# EAGLE design SoundCastel (EAGLE 9.1.1)
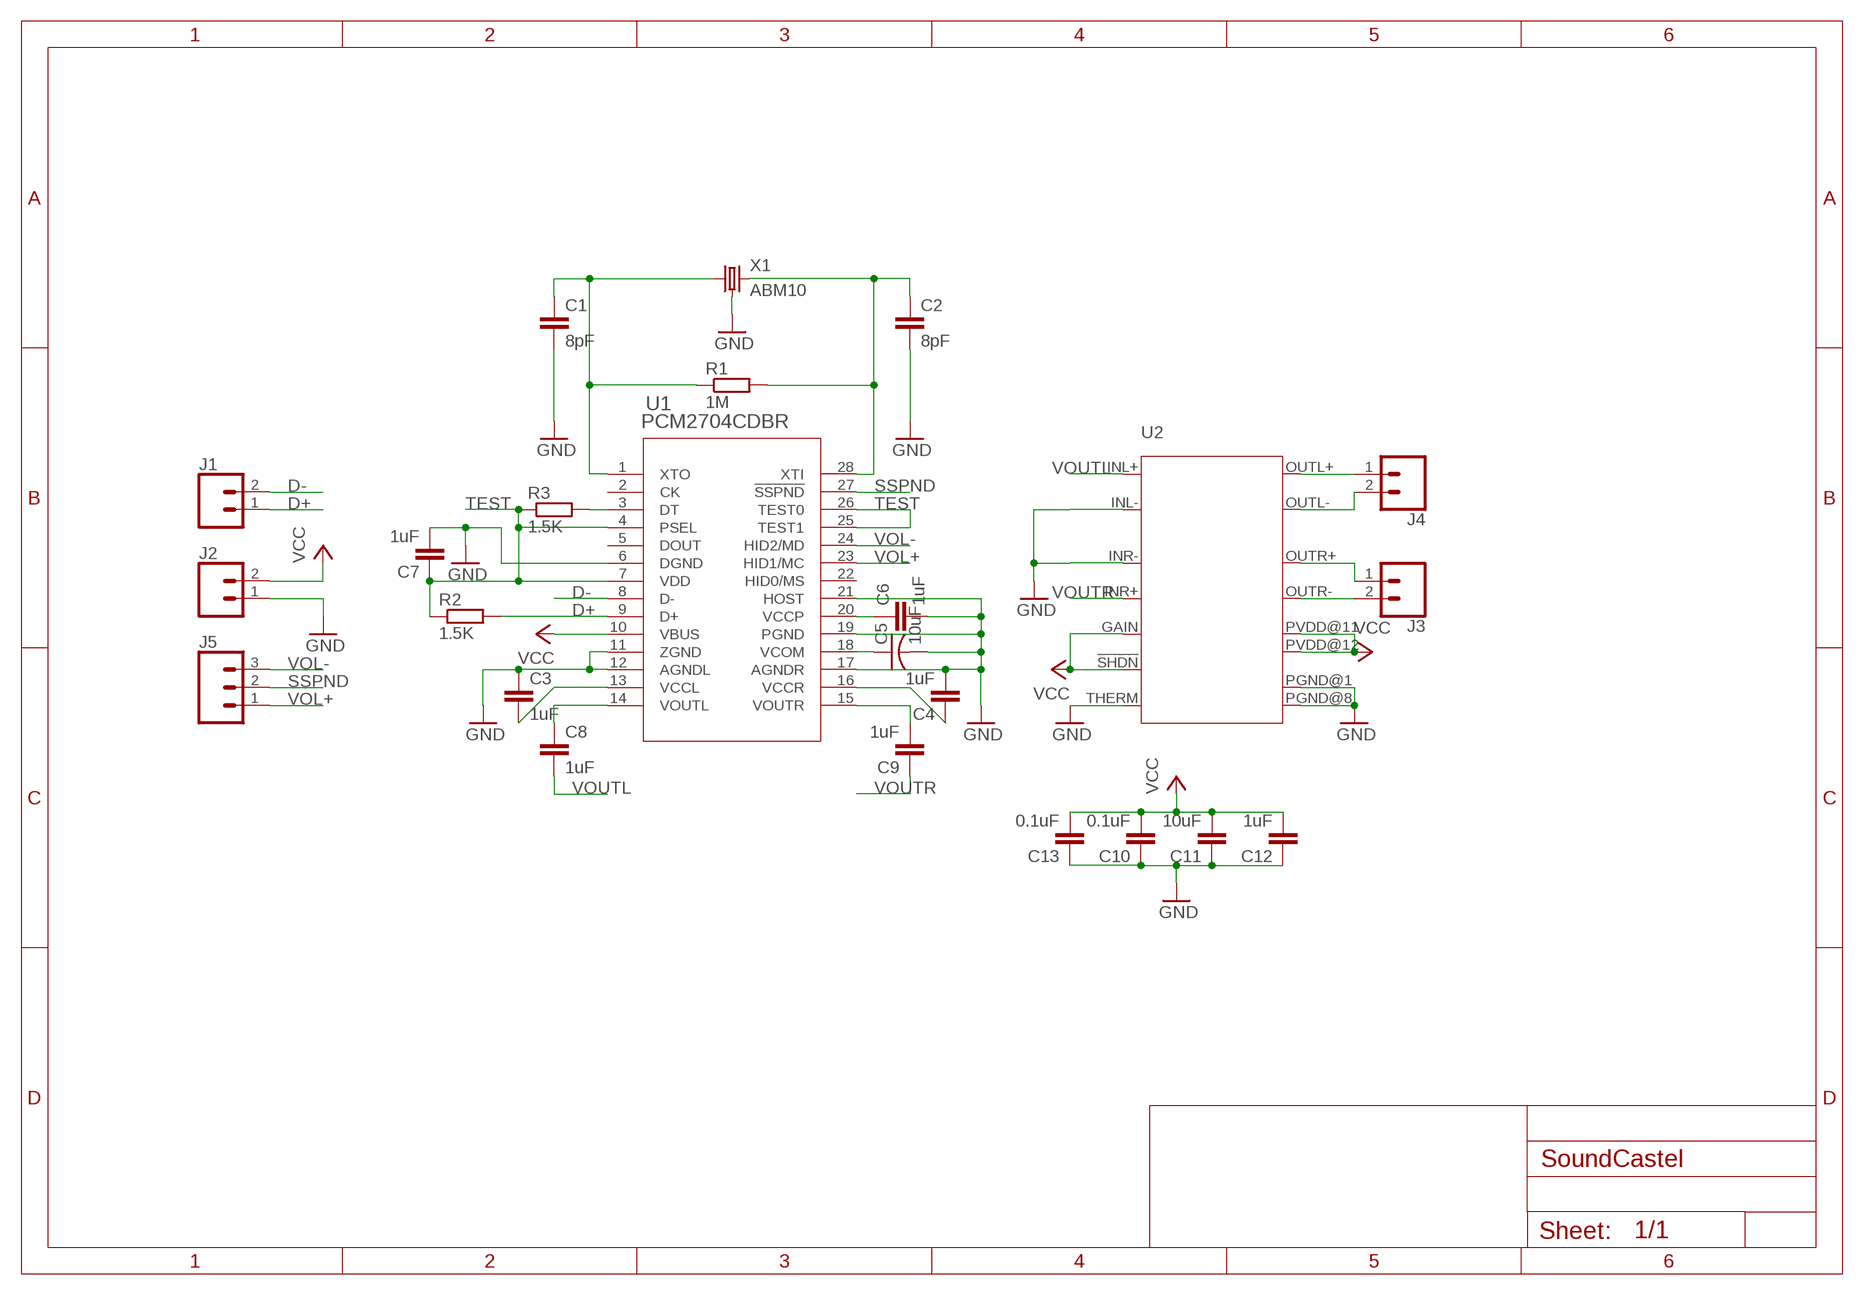
[diagram p0: schematic, sheet 1]

## Parts
C1  8pF  C-EUC0402  [C0402]
C2  8pF  C-EUC0402  [C0402]
C3  1uF  C-EUC0402  [C0402]
C4  1uF  C-EUC0402  [C0402]
C5  10uF  C-USC0402  [C0402]
C6  1uF  C-EUC0402  [C0402]
C7  1uF  C-EUC0402  [C0402]
C8  1uF  C-EUC0402  [C0402]
C9  1uF  C-EUC0402  [C0402]
C10  0.1uF  C-EUC0402  [C0402]
C11  10uF  C-EUC0402  [C0402]
C12  1uF  C-EUC0402  [C0402]
C13  0.1uF  C-EUC0402  [C0402]
J1  CONN_021X02_NO_SILK  [1X02_NO_SILK]
J2  CONN_021X02_NO_SILK  [1X02_NO_SILK]
J3  CONN_021X02_NO_SILK  [1X02_NO_SILK]
J4  CONN_021X02_NO_SILK  [1X02_NO_SILK]
J5  CONN_031X03_NO_SILK  [1X03_NO_SILK]
R1  1M  R-EU_R0402  [R0402]
R2  1.5K  R-EU_R0402  [R0402]
R3  1.5K  R-EU_R0402  [R0402]
U1  PCM2704CDBR  [DB28]
U2  MAX98306  [TDFN14]
X1  ABM10  [ABM10]

## Nets
D+: J1.1 R2.2 U1.9(D+)
D-: J1.2 U1.8(D-)
GND: C1.2 C2.2 C3.1 C4.2 C5.2 C6.2 C7.2 C10.1 C11.1 C12.1 C13.1 J2.1 U1.6(DGND) U1.11(ZGND) U1.12(AGNDL) U1.17(AGNDR) U1.19(PGND) U1.21(HOST) U2.INL- U2.INR- U2.PGND@1 U2.PGND@8 U2.THERM(THERMAL) X1.2 X1.4
N$1: C1.1 R1.1 U1.1(XTO) X1.1
N$2: C2.1 R1.2 U1.28(XTI) X1.3
N$9: C5.1 U1.18(VCOM)
N$10: C6.1 U1.20(VCCP)
N$11: C3.2 U1.13(VCCL)
N$12: C4.1 U1.16(VCCR)
N$14: R3.2 U1.3(DT)
OUTL+: J4.1 U2.OUTL+
OUTL-: J4.2 U2.OUTL-
OUTR+: J3.1 U2.OUTR+
OUTR-: J3.2 U2.OUTR-
SSPND: J5.2 U1.27(!SSPND)
TEST: C7.1 R2.1 R3.1 U1.4(PSEL) U1.7(VDD) U1.25(TEST1) U1.26(TEST0)
VCC: C10.2 C11.2 C12.2 C13.2 J2.2 U1.10(VBUS) U2.!SHDN U2.GAIN U2.PVDD@11 U2.PVDD@12
VOL+: J5.1 U1.23(HID1/MC)
VOL-: J5.3 U1.24(HID2/MD)
VOUTL: C8.2 U2.INL+
VOUTR: C9.1 U2.INR+
XVOUTL: C8.1 U1.14(VOUTL)
XVOUTR: C9.2 U1.15(VOUTR)
Unconnected: U1.2(CK) U1.5(DOUT) U1.22(HID0/MS)

## Library data of the parts
C1-C4 C6-C13 = rcl:C-EU: CAPACITOR, European symbol; SPICEPREFIX: C
C5 = rcl:C-US: CAPACITOR, American symbol; SPICEPREFIX: C
J1-J4 = SparkFun-Connectors:CONN_02: Multi connection point. Often used as Generic Header-pin footprint for 0.1 inch spaced/style header connections On any of the 0.1 inch spaced packages, you can populate with these: Break Away Headers - Straight <https://www.sparkfun.com/products/116> (PRT-00116) Break Away Male Headers - Right Angle <https://www.sparkfun.com/products/553> (PRT-00553) Female Headers <https://www.sparkfun.com/products/115> (PRT-00115) Break Away Headers - Machine Pin <https://www.sparkfun.com/products/117> (PRT-00117) Break Away Female Headers - Swiss Machine Pin <https://www.sparkfun.com/products/743> (PRT-00743) For SCREWTERMINALS and SPRING TERMINALS visit here: Screw Terimnals on SparkFun.com <https://www.sparkfun.com/search/results?term=Screw+Terminals> (5mm/3.5mm/2.54mm spacing) This device is also useful as a general connection point to wire up your design to another part of your project. Our various solder wires solder well into these plated through hole pads. Hook-Up Wire - Assortment (Stranded, 22 AWG) <https://www.sparkfun.com/products/11375> (PRT-11375) Hook-Up Wire - Assortment (Solid Core, 22 AWG) <https://www.sparkfun.com/products/11367> (PRT-11367) View the entire wire category on our website here <https://www.sparkfun.com/categories/141> Special notes: Molex polarized connector foot print use with: PRT-08233 with associated crimp pins and housings. 2.54_SCREWTERM for use with PRT-10571. 3.5mm Screw Terminal footprints for PRT-08084 5mm Screw Terminal footprints for use with PRT-08432
J5 = SparkFun-Connectors:CONN_03: Multi connection point. Often used as Generic Header-pin footprint for 0.1 inch spaced/style header connections On any of the 0.1 inch spaced packages, you can populate with these: Break Away Headers - Straight <https://www.sparkfun.com/products/116> (PRT-00116) Break Away Male Headers - Right Angle <https://www.sparkfun.com/products/553> (PRT-00553) Female Headers <https://www.sparkfun.com/products/115> (PRT-00115) Break Away Headers - Machine Pin <https://www.sparkfun.com/products/117> (PRT-00117) Break Away Female Headers - Swiss Machine Pin <https://www.sparkfun.com/products/743> (PRT-00743) Stackable Header - 3 Pin (Female, 0.1") <https://www.sparkfun.com/products/13875> (PRT-13875) For SCREWTERMINALS and SPRING TERMINALS visit here: Screw Terimnals on SparkFun.com <https://www.sparkfun.com/search/results?term=Screw+Terminals> (5mm/3.5mm/2.54mm spacing) This device is also useful as a general connection point to wire up your design to another part of your project. Our various solder wires solder well into these plated through hole pads. Hook-Up Wire - Assortment (Stranded, 22 AWG) <https://www.sparkfun.com/products/11375> (PRT-11375) Hook-Up Wire - Assortment (Solid Core, 22 AWG) <https://www.sparkfun.com/products/11367> (PRT-11367) View the entire wire category on our website here <https://www.sparkfun.com/categories/141> Special notes: Molex polarized connector foot print use with SKU : PRT-08232 with associated crimp pins and housings.
R1-R3 = rcl:R-EU_: RESISTOR, European symbol; SPICEPREFIX: R
U1 = SoundCastel:PCM2704CDBR; MANUFACTURER_PART_NUMBER: PCM2704CDBR; VENDOR: Texas Instruments
U2 = SoundCastel:MAX98306
X1 = USBCastel:ABM10

## Board
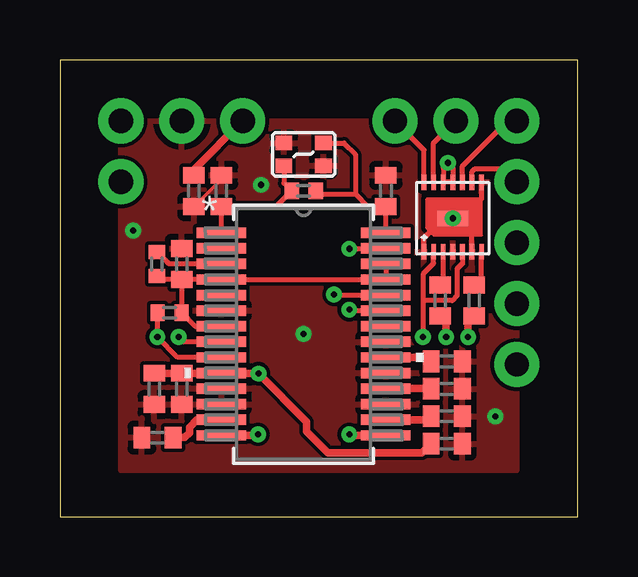
[diagram p1: board, top side]
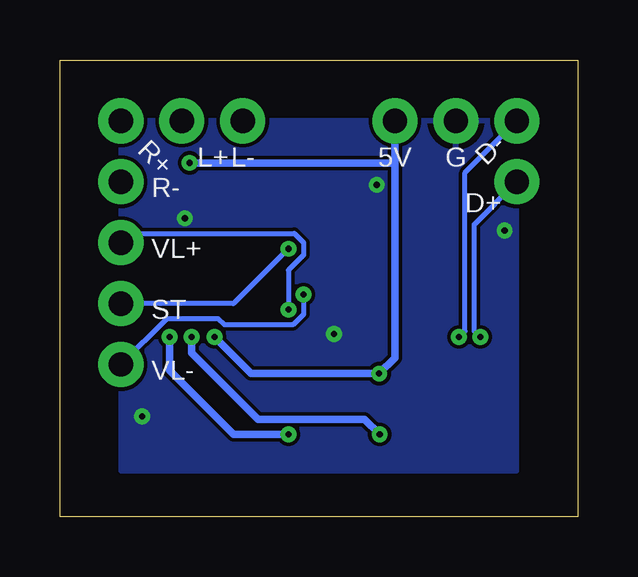
[diagram p2: board, bottom side, seen from below]

Size 21.59 x 19.05 mm. Coordinates in mm from the lower left corner, seen from the top.
Outline: 0,0 21.59,0 21.59,19.05 0,19.05 0,0
Copper layers (1*16): Top 0.035mm / dielectric 1.5mm / Bottom 0.035mm
Design rules "default": minimum track width 6mil, minimum drill 0.35mm, track to track 6mil, track to pad 6mil, pad to pad 6mil, via to via 6mil, smd to smd 6mil, copper to edge 40mil, drill to drill 6mil, minimum pad ring 10mil, minimum via ring 8mil, stop-mask expansion 4mil, vias tented up to drill 0mil, thermal gap 10mil

### Footprints (pad centres in the part's own frame; a part is rotated, then mirrored left to right if it is on the bottom)
C0402 = smd 0.7 x 0.9: 1 -0.65,0; 2 0.65,0
1X02_NO_SILK = drill 1.016 pad 1.88: 1 0,0; 2 2.54,0
1X03_NO_SILK = drill 1.016 pad 1.88: 1 0,0; 2 2.54,0; 3 5.08,0
R0402 = smd 0.6 x 0.7: 1 -0.5,0; 2 0.5,0
DB28 = smd 2.057 x 0.432: 1 -3.429,4.225; 2 -3.429,3.575; 3 -3.429,2.925; 4 -3.429,2.275; 5 -3.429,1.625; 6 -3.429,0.975; 7 -3.429,0.325; 8 -3.429,-0.325; 9 -3.429,-0.975; 10 -3.429,-1.625; 11 -3.429,-2.275; 12 -3.429,-2.925; 13 -3.429,-3.575; 14 -3.429,-4.225; 15 3.429,-4.225; 16 3.429,-3.575; 17 3.429,-2.925; 18 3.429,-2.275; 19 3.429,-1.625; 20 3.429,-0.975; 21 3.429,-0.325; 22 3.429,0.325; 23 3.429,0.975; 24 3.429,1.625; 25 3.429,2.275; 26 3.429,2.925; 27 3.429,3.575; 28 3.429,4.225
TDFN14 = smd 0.2 x 0.64: !SHDN 0.8,1.4; GAIN -0.4,1.4; INL+ 0.4,1.4; INL- 0,1.4; INR+ -1.2,1.4; INR- -0.8,1.4; OUTL+ 0.8,-1.5; OUTL- 1.2,-1.5; OUTR+ -0.4,-1.5; OUTR- -0.8,-1.5; PGND@1 1.2,1.4; PGND@8 -1.2,-1.5; PVDD@11 0,-1.5; PVDD@12 0.4,-1.5 | smd 1.27 x 0.635: THERM 0,0
ABM10 = smd 0.7 x 0.6: 1 -0.825,-0.475; 2 0.825,-0.475; 3 0.825,0.475; 4 -0.825,0.475

### Placement (x,y rotation side)
C1  6.73,13.59 90 top
C2  13.59,13.59 90 top
C3  4.06,3.3 0 top
C4  16.13,4.19 0 top
C5  16.13,5.33 0 top
C6  16.13,6.48 0 top
C7  5.08,10.54 90 top
C8  15.85,9.02 90 top
C9  17.27,9.02 270 top
C10  5.08,5.33 90 top
C11  3.94,5.33 90 top
C12  16.13,3.05 180 top
C13  5.59,13.59 90 top
J1  2.54,13.97 90 top
J2  5.08,16.51 0 top
J3  19.05,16.51 270 top
J4  16.51,16.51 180 top
J5  19.05,11.43 270 top
R1  10.16,13.59 0 top
R2  4.57,8.51 180 top
R3  4.04,10.54 90 top
U1  10.16,7.62 0 top
U2  16.38,12.45 180 top
X1  10.16,15.11 0 top

### Tracks (layer width: path | path; a pad name or v marks a point on that pad's centre or on a via)
D+  (via drill 0.25)
  Top 0.203: 4.07,8.6 R2.2 v4.06,7.49 4.91,6.64 U1.9
  Bottom 0.203: v4.06,7.49 4.32,7.75 4.32,12.19 J1.1
D-  (via drill 0.25)
  Top 0.203: U1.8 5.15,7.29 v4.95,7.49
  Bottom 0.203: v4.95,7.49 4.7,7.75 4.7,14.35 J1.2
GND  (via drill 0.25)
  Top 0.152: C13.1 6.73,14.08 C1.2
  Top 0.2: U2.PGND@8 17.58,13.27 16.76,12.45 16.51,12.45 | 16.51,12.45 U2.THERM | U2.PGND@1 15.18,11.63 16,12.45 16.51,12.45 | U2.INR- 17.18,11.77 16.51,12.45
  other vias: 16.38,12.45 3.05,11.94 10.16,7.62 8.38,13.84 18.16,4.19
  pour Top: 2.54,16.51 19.05,16.51 19.05,4.45 19.05,1.91 5.71,1.91 2.54,1.91
  pour Bottom: 2.54,16.51 19.05,16.51 19.05,1.91 2.54,1.91
N$1
  Top 0.203: U1.1 C1.1 9.01,12.94 R1.1 9.34,13.91 X1.1
N$2
  Top 0.203: U1.28 C2.1 12.83,12.94 12.32,13.45 | X1.3 11.84,15.59 12.32,15.11 12.32,13.45 | R1.2 10.8,13.45 12.32,13.45
N$9
  Top 0.305: U1.18 15.47,5.34 C5.1
N$10
  Top 0.305: C6.1 15.31,6.64 U1.20
N$11
  Top 0.305: U1.13 5.71,4.04 5.4,3.74 5.4,3.49 5.21,3.3 C3.2
N$12
  Top 0.305: U1.16 15.33,4.04 C4.1
N$14
  Top 0.203: U1.3 4.54,10.54 4.49,10.6 R3.2
OUTL+
  Top 0.2: U2.OUTL+ 15.58,15.58 J4.1
OUTL-
  Top 0.2: U2.OUTL- 15.18,15.3 J4.2
OUTR+
  Top 0.2: U2.OUTR+ 16.78,14.62 18.67,16.51 J3.1
OUTR-
  Top 0.2: U2.OUTR- 17.18,14.39 17.31,14.52 18.5,14.52 J3.2
SSPND  (via drill 0.25)
  Top 0.203: v12.06,11.18 12.08,11.2 U1.27
  Bottom 0.203: v12.06,11.18 14.35,8.89 J5.2
TEST
  Top 0.203: C7.1 U1.4 U1.25 U1.26 | C7.1 4.19,9.89 R3.1 | C7.1 R2.1 5.64,7.95 U1.7
VCC  (via drill 0.25)
  Top 0.2: U2.GAIN 16.78,10.56 16.56,10.34 16.56,9.22 16.36,9.02 15.14,9.02 | U2.!SHDN 15.58,10.57 15.14,10.12 15.14,9.02 | 15.14,9.02 v15.14,7.49 | U2.PVDD@11 U2.PVDD@12 15.98,14.56 v16.18,14.76 16.38,14.55 U2.PVDD@11
  Top 0.305: C11.2 C10.2 6.72,5.98 U1.10 6.76,5.97 v8.28,5.97 10.29,3.96 10.29,3.56 11.18,2.67 15.1,2.67 C12.2 | J2.2 5.59,14.48 C13.2
  Bottom 0.305: v15.14,7.49 13.61,5.97 v8.28,5.97 7.62,6.63 7.62,14.73 | J2.2 7.62,14.73 | v16.18,14.76 7.64,14.76 7.62,14.73
VOL+  (via drill 0.25)
  Top 0.203: v12.06,8.64 12.11,8.6 U1.23
  Bottom 0.203: J5.1 18.67,11.81 11.81,11.81 11.43,11.43 11.43,10.92 12.06,10.29 v12.06,8.64
VOL-  (via drill 0.25)
  Top 0.203: v11.43,9.27 11.46,9.24 U1.24
  Bottom 0.203: v11.43,9.27 11.43,8.45 11.87,8 14.73,8 14.99,8.26 17.14,8.26 J5.3
VOUTL
  Top 0.2: C8.2 15.98,9.8 U2.INL+
VOUTR
  Top 0.2: C9.1 17.58,9.98 U2.INR+
XVOUTL  (via drill 0.25)
  Top 0.305: v16.1,7.49 16.1,8.11 C8.1 | v8.26,3.43 8.22,3.4 U1.14
  Bottom 0.305: v8.26,3.43 8.89,4.06 13.34,4.06 16.1,6.83 v16.1,7.49
XVOUTR  (via drill 0.25)
  Top 0.305: v17.02,7.49 17.02,8.11 C9.2 | v12.06,3.43 12.1,3.4 U1.15
  Bottom 0.305: v17.02,7.49 17.02,6.1 14.35,3.43 v12.06,3.43

### Text on the board
bPlace: D- | G | 5V | L- | L+ | R+ | D+ | R- | VL+ | ST | VL-